# Altium project ecs8a.PrjPcb
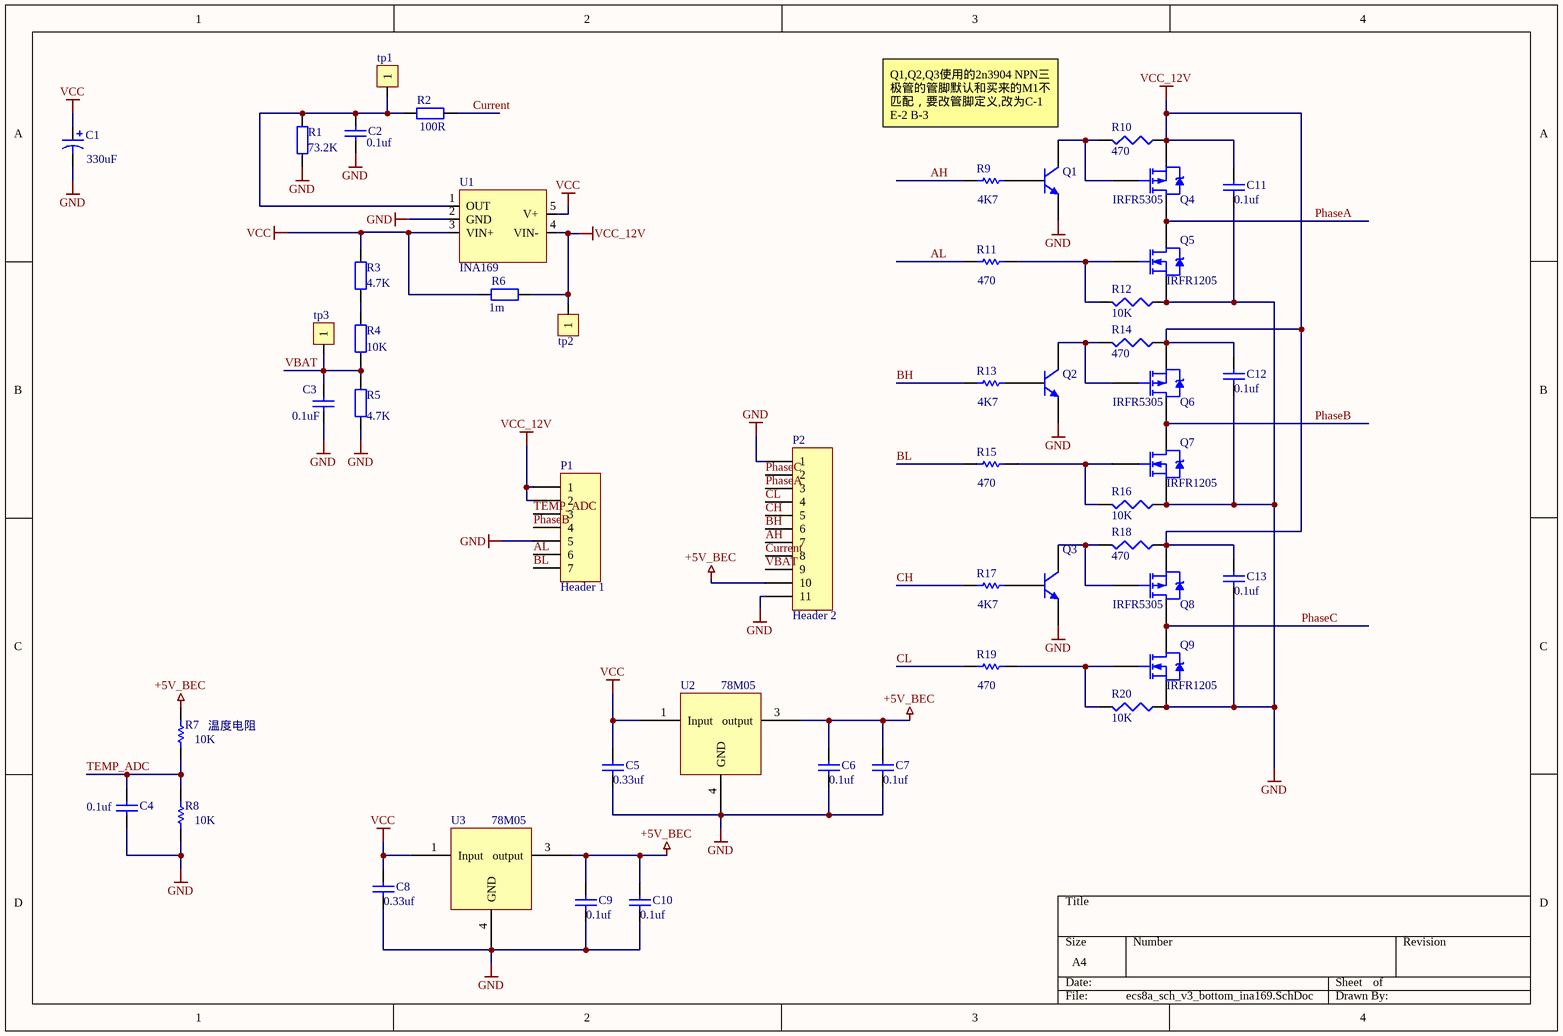
[diagram p0: ecs8a_sch_v3_bottom_ina169.SchDoc]
3 sheets, 131 parts. Net scope: global (net labels, ports and power ports of the same name join across sheets).
Board files: ecs8a_v3_bottom_ina169.PcbDoc, ecs8a_v3_bottom.PcbDoc, ecs8a_v3_top.PcbDoc
Sheets:
  ecs8a_sch_v3_bottom_ina169.SchDoc
  ecs8a_sch_v3_bottom.SchDoc
  ecs8a_sch_v3_top.SchDoc

## Sheet ecs8a_sch_v3_bottom_ina169.SchDoc
size A4

### Parts
(Parts that share a designator on the sheet are numbered #1, #2 ... from top to bottom, then left to right.)
C1#1  value 330uF  [D_C]  (hidden comment: Cap Pol1)
C2#1  value 0.1uf  [6-0805_L]  (hidden comment: Cap)
C3#1  value 0.1uF  [6-0805_L]  (hidden comment: Cap)
C4#1  value 0.1uf  [6-0805_L]  (hidden comment: Cap)
C5#1  value 0.33uf  [C1206]  (hidden comment: Cap)
C6#1  value 0.1uf  [6-0805_L]  (hidden comment: Cap)
C7#1  value 0.1uf  [6-0805_L]  (hidden comment: Cap)
C8#1  value 0.33uf  [C1206]  (hidden comment: Cap)
C9#1  value 0.1uf  [6-0805_L]  (hidden comment: Cap)
C10#1  value 0.1uf  [6-0805_L]  (hidden comment: Cap)
C11#1  value 0.1uf  [6-0805_L]  (hidden comment: Cap)
C12#1  value 0.1uf  [6-0805_L]  (hidden comment: Cap)
C13#1  value 0.1uf  [6-0805_L]  (hidden comment: Cap)
P1#1  Header 1  [7PIN_2.54]
P2#1  Header 2  [11PIN_2.54]
Q1#1  2N3904  [SOT23_L]  (value not drawn)
Q2#1  2N3904  [SOT23_L]  (value not drawn)
Q3#1  2N3904  [SOT23_L]  (value not drawn)
Q4#1  IRFR5305  [TO-252AA]
Q5#1  IRFR1205  [TO-252AA]
Q6#1  IRFR5305  [TO-252AA]
Q7#1  IRFR1205  [TO-252AA]
Q8#1  IRFR5305  [TO-252AA]
Q9#1  IRFR1205  [TO-252AA]
R1#1  value 73.2K  [0603]  (hidden comment: Res2)
R2#1  value 100R  [6-0805_L]  (hidden comment: Res2)
R3#1  value 4.7K  [6-0805_L]  (hidden comment: Res2)
R4#1  value 10K  [6-0805_L]  (hidden comment: Res2)
R5#1  value 4.7K  [6-0805_L]  (hidden comment: Res2)
R6#1  value 1m  [2512_R]  (hidden comment: Res2)
R7#1  温度电阻  value 10K  [6-0805_L]
R8#1  value 10K  [6-0805_L]  (hidden comment: Res1)
R9#1  value 4K7  [6-0805_L]  (hidden comment: Res1)
R10#1  value 470  [6-0805_L]  (hidden comment: Res3)
R11#1  value 470  [6-0805_L]  (hidden comment: Res1)
R12#1  value 10K  [6-0805_L]  (hidden comment: Res3)
R13#1  value 4K7  [6-0805_L]  (hidden comment: Res1)
R14#1  value 470  [6-0805_L]  (hidden comment: Res3)
R15#1  value 470  [6-0805_L]  (hidden comment: Res1)
R16#1  value 10K  [6-0805_L]  (hidden comment: Res3)
R17#1  value 4K7  [6-0805_L]  (hidden comment: Res1)
R18#1  value 470  [6-0805_L]  (hidden comment: Res3)
R19  value 470  [6-0805_L]  (hidden comment: Res1)
R20  value 10K  [6-0805_L]  (hidden comment: Res3)
tp1#1  tp  [tp]  (value not drawn)
tp2  tp  [tp]  (value not drawn)
tp3  tp  [tp]  (value not drawn)
U1#1  INA169  [SOT23-5]
U2#1  78M05  [TO-252AA]
U3#1  78M05  [TO-252AA]

### Nets
+5V_BEC: C6#1.1 C7#1.1 C9#1.1 C10#1.1 P2#1.10 R7#1.2 U2#1.3(output) U3#1.3(output)
GND: C1#1.2 C2#1.1 C3#1.1 C4#1.1 C5#1.2 C6#1.2 C7#1.2 C8#1.2 C9#1.2 C10#1.2 C11#1.1 C12#1.1 C13#1.1 P1#1.5 P2#1.1 P2#1.11 Q1#1.2(E) Q2#1.2(E) Q3#1.2(E) Q5#1.3(S) Q7#1.3(S) Q9#1.3(S) R1#1.1 R5#1.1 R8#1.1 R12#1.1 R16#1.1 R20.1 U1#1.2(GND) U2#1.4(GND) U3#1.4(GND)
VCC: C1#1.1 C5#1.1 C8#1.1 R3#1.2 R6#1.1 U1#1.3(VIN+) U1#1.5(V+) U2#1.1(Input) U3#1.1(Input)
VCC_12V: C11#1.2 C12#1.2 C13#1.2 P1#1.1 P1#1.2 Q4#1.3(S) Q6#1.3(S) Q8#1.3(S) R6#1.2 R10#1.1 R14#1.1 R18#1.1 tp2.1 U1#1.4(VIN-)
AH: P2#1.7 R9#1.2
AL: P1#1.6 R11#1.2
BH: P2#1.6 R13#1.2
BL: P1#1.7 R15#1.2
CH: P2#1.5 R17#1.2
CL: P2#1.4 R19.2
Current: P2#1.8 R2#1.2
PhaseA: P2#1.3 Q4#1.4(D) Q5#1.4(D)
PhaseB: P1#1.4 Q6#1.4(D) Q7#1.4(D)
PhaseC: P2#1.2 Q8#1.4(D) Q9#1.4(D)
TEMP_ADC: C4#1.2 P1#1.3 R7#1.1 R8#1.2
VBAT: C3#1.2 P2#1.9 R4#1.1 R5#1.2 tp3.1
NetC2#1_2: C2#1.2 R1#1.2 R2#1.1 tp1#1.1 U1#1.1(OUT)
NetQ1#1_1: Q1#1.1(C) Q4#1.1(G) R10#1.2
NetQ1#1_3: Q1#1.3(B) R9#1.1
NetQ2#1_1: Q2#1.1(C) Q6#1.1(G) R14#1.2
NetQ2#1_3: Q2#1.3(B) R13#1.1
NetQ3#1_1: Q3#1.1(C) Q8#1.1(G) R18#1.2
NetQ3#1_3: Q3#1.3(B) R17#1.1
NetQ5#1_1: Q5#1.1(G) R11#1.1 R12#1.2
NetQ7#1_1: Q7#1.1(G) R15#1.1 R16#1.2
NetQ9#1_1: Q9#1.1(G) R19.1 R20.2
NetR3#1_1: R3#1.1 R4#1.2

### Notes on the sheet
- Q1,Q2,Q3使用的2n3904 NPN三极管的管脚默认和买来的M1不匹配，要改管脚定义,改为C-1 E-2 B-3

### Library data of the parts
C1#1 = Cap Pol1: Polarized Capacitor (Radial); Published: 8-Jun-2000; LatestRevisionDate: 17-Jul-2002; LatestRevisionNote: Re-released for DXP Platform.; PackageReference: RB7.6-15; Publisher: Altium Limited; PackageDescription: Polarized Capacitor (Radial); 2 Leads
C2#1 C3#1 C4#1 C5#1 C6#1 C7#1 C8#1 C9#1 C10#1 C11#1 C12#1 C13#1 = Cap: Capacitor; Published: 8-Jun-2000; LatestRevisionDate: 17-Jul-2002; LatestRevisionNote: Re-released for DXP Platform.; PackageReference: RAD-0.3; Publisher: Altium Limited; PackageDescription: Radial Cap, Thru-Hole; 2 Leads; 0.3 in Pin Spacing
P1#1 = Header 7: Header, 7-Pin; LatestRevisionDate: 17-Jul-2002; LatestRevisionNote: Re-released for DXP Platform.; Publisher: Altium Limited
P2#1 = Header 11: Header, 11-Pin; LatestRevisionDate: 17-Jul-2002; LatestRevisionNote: Re-released for DXP Platform.; Publisher: Altium Limited
Q1#1 Q2#1 Q3#1 = 2N3904: NPN General Purpose Amplifier; Published: 8-Jun-2000; LatestRevisionDate: 15-Jan-2003; LatestRevisionNote: PCB Footprint 'BCY-W3/D4.7' replaced; DatasheetVersion: 1997; PackageVersion: Sep-1998; PackageReference: TO-92A; Publisher: Altium Limited; PackageDescription: TO, Flat Index; 3 In-Line, Axial Leads; Body Dia. 4.5mm; Leads 0.51 x 0.48 mm (max); ComponentLink1Description: Manufacturer Link; ComponentLink1URL: http://www.fairchildsemi.com/; ComponentLink2Description: Datasheet; ComponentLink2URL: http://www.fairchildsemi.com/ds/2N%2F2N3904.pdf
Q4#1 Q6#1 Q8#1 = IRFR5305: HEXFET Power MOSFET; Manufacturer: International Rectifier; Class I: Discrete; Class II: MOSFET - Power; Note: Pin 2 is trimmed and is electrically connected to Drain.; Published: 8-Jun-2000; Revision: July-2002: Re-released for DXP Platform.; Datasheet: Latest Revision: PD-9.1402; Package Reference: TO-252AA; Publisher: Altium Limited
Q5#1 Q7#1 Q9#1 = IRFR1205: HEXFET Power MOSFET; Manufacturer: International Rectifier; Class I: Discrete; Class II: MOSFET - Power; Note: Pin 2 is trimmed and is electrically connected to Drain.; Published: 8-Jun-2000; Revision: July-2002: Re-released for DXP Platform.; Datasheet: Latest Revision: PD-91318B; Package Reference: TO-252AA; Publisher: Altium Limited
R1#1 R2#1 R3#1 R4#1 R5#1 R6#1 = Res2: Resistor; Published: 8-Jun-2000; LatestRevisionDate: 17-Jul-2002; LatestRevisionNote: Re-released for DXP Platform.; PackageReference: AXIAL-0.4; Publisher: Altium Limited; PackageDescription: Axial Device, Thru-Hole; 2 Leads; 0.4 in Pin Spacing
R7#1 R8#1 R9#1 R11#1 R13#1 R15#1 R17#1 R19 = Res1: Resistor; Published: 8-Jun-2000; LatestRevisionDate: 17-Jul-2002; LatestRevisionNote: Re-released for DXP Platform.; PackageReference: AXIAL-0.3; Publisher: Altium Limited; PackageDescription: Axial Device, Thru-Hole; 2 Leads; 0.3 in Pin Spacing
R10#1 R12#1 R14#1 R16#1 R18#1 R20 = Res3: Resistor; Published: 8-Jun-2000; LatestRevisionDate: 29-May-2009; LatestRevisionNote: IPC-7351 Footprint Added.; PackageReference: J1-0603; Publisher: Altium Limited; PackageDescription: Chip Resistor
U2#1 U3#1 = Component_1

## Sheet ecs8a_sch_v3_bottom.SchDoc
size A4
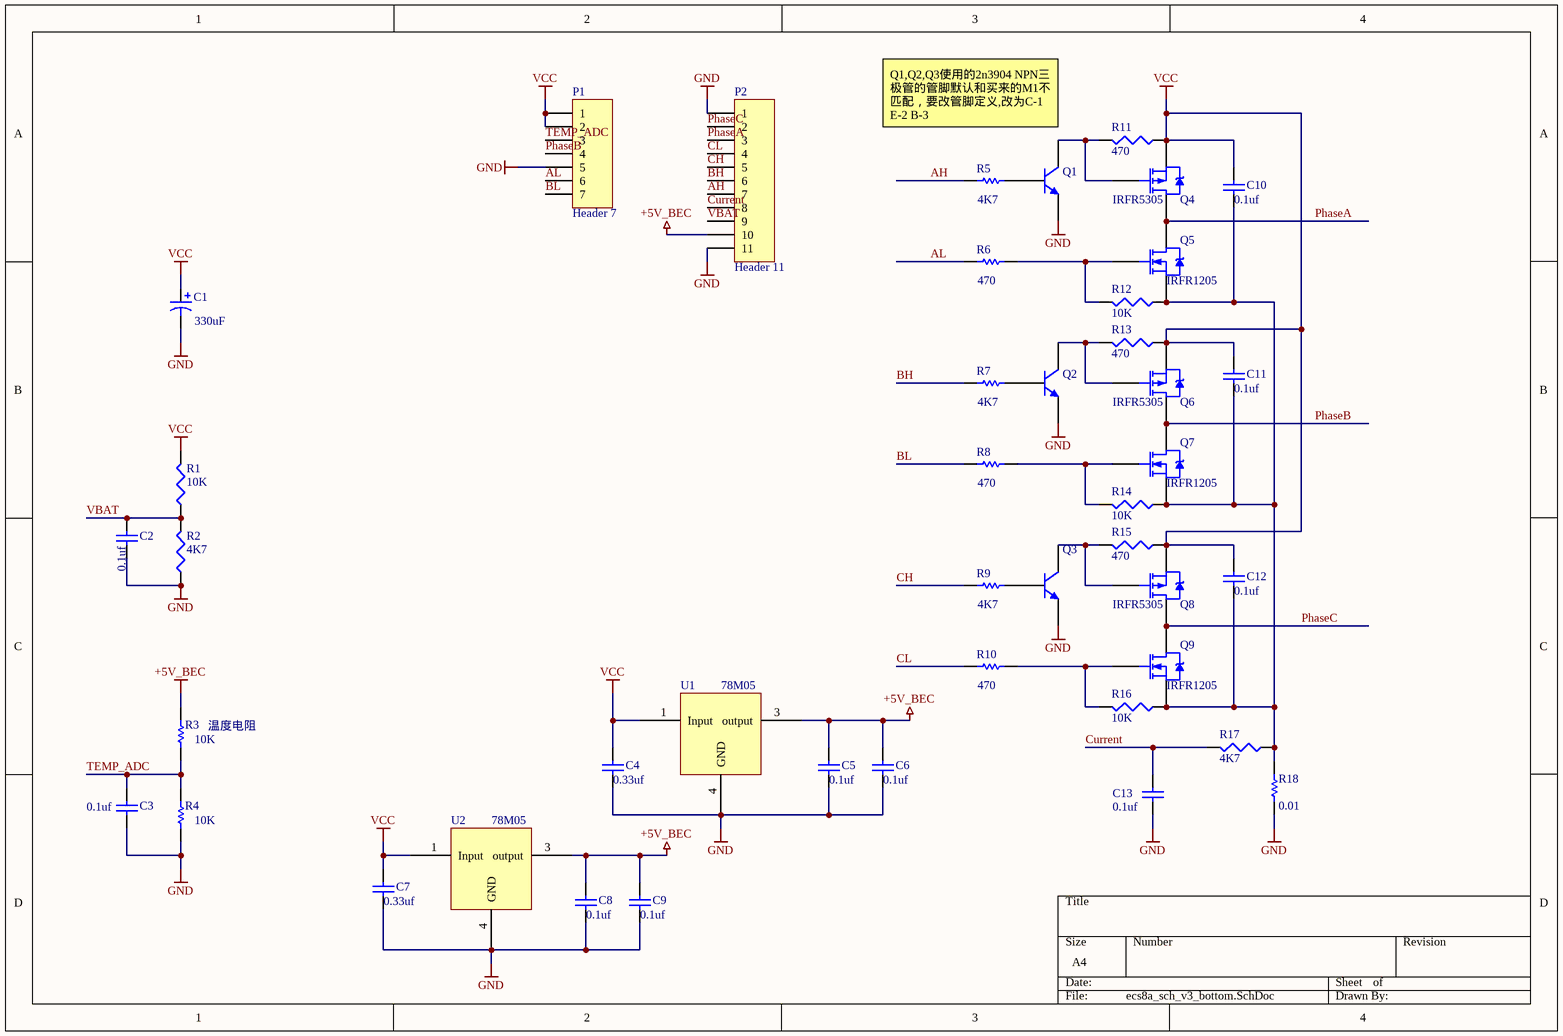
[diagram p1: ecs8a_sch_v3_bottom.SchDoc]

### Parts
(Parts that share a designator on the sheet are numbered #1, #2 ... from top to bottom, then left to right.)
C1#2  value 330uF  [D_C]  (hidden comment: Cap Pol1)
C2#2  value 0.1uf  [6-0805_L]  (hidden comment: Cap)
C3#2  value 0.1uf  [6-0805_L]  (hidden comment: Cap)
C4#2  value 0.33uf  [C1206]  (hidden comment: Cap)
C5#2  value 0.1uf  [6-0805_L]  (hidden comment: Cap)
C6#2  value 0.1uf  [6-0805_L]  (hidden comment: Cap)
C7#2  value 0.33uf  [C1206]  (hidden comment: Cap)
C8#2  value 0.1uf  [6-0805_L]  (hidden comment: Cap)
C9#2  value 0.1uf  [6-0805_L]  (hidden comment: Cap)
C10#2  value 0.1uf  [6-0805_L]  (hidden comment: Cap)
C11#2  value 0.1uf  [6-0805_L]  (hidden comment: Cap)
C12#2  value 0.1uf  [6-0805_L]  (hidden comment: Cap)
C13#2  value 0.1uf  [6-0805_L]  (hidden comment: Cap)
P1#2  Header 7  [7PIN_2.54]
P2#2  Header 11  [11PIN_2.54]
Q1#2  2N3904  [SOT23_L]  (value not drawn)
Q2#2  2N3904  [SOT23_L]  (value not drawn)
Q3#2  2N3904  [SOT23_L]  (value not drawn)
Q4#2  IRFR5305  [TO-252AA]
Q5#2  IRFR1205  [TO-252AA]
Q6#2  IRFR5305  [TO-252AA]
Q7#2  IRFR1205  [TO-252AA]
Q8#2  IRFR5305  [TO-252AA]
Q9#2  IRFR1205  [TO-252AA]
R1#2  value 10K  [6-0805_L]  (hidden comment: Res3)
R2#2  value 4K7  [6-0805_L]  (hidden comment: Res3)
R3#2  温度电阻  value 10K  [6-0805_L]
R4#2  value 10K  [6-0805_L]  (hidden comment: Res1)
R5#2  value 4K7  [6-0805_L]  (hidden comment: Res1)
R6#2  value 470  [6-0805_L]  (hidden comment: Res1)
R7#2  value 4K7  [6-0805_L]  (hidden comment: Res1)
R8#2  value 470  [6-0805_L]  (hidden comment: Res1)
R9#2  value 4K7  [6-0805_L]  (hidden comment: Res1)
R10#2  value 470  [6-0805_L]  (hidden comment: Res1)
R11#2  value 470  [6-0805_L]  (hidden comment: Res3)
R12#2  value 10K  [6-0805_L]  (hidden comment: Res3)
R13#2  value 470  [6-0805_L]  (hidden comment: Res3)
R14#2  value 10K  [6-0805_L]  (hidden comment: Res3)
R15#2  value 470  [6-0805_L]  (hidden comment: Res3)
R16#2  value 10K  [6-0805_L]  (hidden comment: Res3)
R17#2  value 4K7  [6-0805_L]  (hidden comment: Res3)
R18#2  value 0.01  [2512_R]  (hidden comment: Res1)
U1#2  78M05  [TO-252AA]
U2#2  78M05  [TO-252AA]

### Nets
+5V_BEC: C5#2.1 C6#2.1 C8#2.1 C9#2.1 P2#2.10 R3#2.2 U1#2.3(output) U2#2.3(output)
GND: C1#2.2 C2#2.2 C3#2.1 C4#2.2 C5#2.2 C6#2.2 C7#2.2 C8#2.2 C9#2.2 C13#2.1 P1#2.5 P2#2.1 P2#2.11 Q1#2.2(E) Q2#2.2(E) Q3#2.2(E) R2#2.1 R4#2.1 R18#2.1 U1#2.4(GND) U2#2.4(GND)
VCC: C1#2.1 C4#2.1 C7#2.1 C10#2.2 C11#2.2 C12#2.2 P1#2.1 P1#2.2 Q4#2.3(S) Q6#2.3(S) Q8#2.3(S) R1#2.2 R11#2.1 R13#2.1 R15#2.1 U1#2.1(Input) U2#2.1(Input)
AH: P2#2.7 R5#2.2
AL: P1#2.6 R6#2.2
BH: P2#2.6 R7#2.2
BL: P1#2.7 R8#2.2
CH: P2#2.5 R9#2.2
CL: P2#2.4 R10#2.2
Current: C13#2.2 P2#2.8 R17#2.2
PhaseA: P2#2.3 Q4#2.4(D) Q5#2.4(D)
PhaseB: P1#2.4 Q6#2.4(D) Q7#2.4(D)
PhaseC: P2#2.2 Q8#2.4(D) Q9#2.4(D)
TEMP_ADC: C3#2.2 P1#2.3 R3#2.1 R4#2.2
VBAT: C2#2.1 P2#2.9 R1#2.1 R2#2.2
NetC10#2_1: C10#2.1 C11#2.1 C12#2.1 Q5#2.3(S) Q7#2.3(S) Q9#2.3(S) R12#2.1 R14#2.1 R16#2.1 R17#2.1 R18#2.2
NetQ1#2_1: Q1#2.1(C) Q4#2.1(G) R11#2.2
NetQ1#2_3: Q1#2.3(B) R5#2.1
NetQ2#2_1: Q2#2.1(C) Q6#2.1(G) R13#2.2
NetQ2#2_3: Q2#2.3(B) R7#2.1
NetQ3#2_1: Q3#2.1(C) Q8#2.1(G) R15#2.2
NetQ3#2_3: Q3#2.3(B) R9#2.1
NetQ5#2_1: Q5#2.1(G) R6#2.1 R12#2.2
NetQ7#2_1: Q7#2.1(G) R8#2.1 R14#2.2
NetQ9#2_1: Q9#2.1(G) R10#2.1 R16#2.2

### Notes on the sheet
- Q1,Q2,Q3使用的2n3904 NPN三极管的管脚默认和买来的M1不匹配，要改管脚定义,改为C-1 E-2 B-3

### Library data of the parts
C1#2 = Cap Pol1: Polarized Capacitor (Radial); Published: 8-Jun-2000; LatestRevisionDate: 17-Jul-2002; LatestRevisionNote: Re-released for DXP Platform.; PackageReference: RB7.6-15; Publisher: Altium Limited; PackageDescription: Polarized Capacitor (Radial); 2 Leads
C2#2 C3#2 C4#2 C5#2 C6#2 C7#2 C8#2 C9#2 C10#2 C11#2 C12#2 C13#2 = Cap: Capacitor; Published: 8-Jun-2000; LatestRevisionDate: 17-Jul-2002; LatestRevisionNote: Re-released for DXP Platform.; PackageReference: RAD-0.3; Publisher: Altium Limited; PackageDescription: Radial Cap, Thru-Hole; 2 Leads; 0.3 in Pin Spacing
P1#2 = Header 7: Header, 7-Pin; LatestRevisionDate: 17-Jul-2002; LatestRevisionNote: Re-released for DXP Platform.; Publisher: Altium Limited
P2#2 = Header 11: Header, 11-Pin; LatestRevisionDate: 17-Jul-2002; LatestRevisionNote: Re-released for DXP Platform.; Publisher: Altium Limited
Q1#2 Q2#2 Q3#2 = 2N3904: NPN General Purpose Amplifier; Published: 8-Jun-2000; LatestRevisionDate: 15-Jan-2003; LatestRevisionNote: PCB Footprint 'BCY-W3/D4.7' replaced; DatasheetVersion: 1997; PackageVersion: Sep-1998; PackageReference: TO-92A; Publisher: Altium Limited; PackageDescription: TO, Flat Index; 3 In-Line, Axial Leads; Body Dia. 4.5mm; Leads 0.51 x 0.48 mm (max); ComponentLink1Description: Manufacturer Link; ComponentLink1URL: http://www.fairchildsemi.com/; ComponentLink2Description: Datasheet; ComponentLink2URL: http://www.fairchildsemi.com/ds/2N%2F2N3904.pdf
Q4#2 Q6#2 Q8#2 = IRFR5305: as Q4#1 on sheet ecs8a_sch_v3_bottom_ina169; Published: 8-Jun-2000; Revision: July-2002: Re-released for DXP Platform.; Datasheet: Latest Revision: PD-9.1402; Package Reference: TO-252AA; Publisher: Altium Limited
Q5#2 Q7#2 Q9#2 = IRFR1205: as Q5#1 on sheet ecs8a_sch_v3_bottom_ina169; Published: 8-Jun-2000; Revision: July-2002: Re-released for DXP Platform.; Datasheet: Latest Revision: PD-91318B; Package Reference: TO-252AA; Publisher: Altium Limited
R1#2 R2#2 R11#2 R12#2 R13#2 R14#2 R15#2 R16#2 R17#2 = Res3: Resistor; Published: 8-Jun-2000; LatestRevisionDate: 29-May-2009; LatestRevisionNote: IPC-7351 Footprint Added.; PackageReference: J1-0603; Publisher: Altium Limited; PackageDescription: Chip Resistor
R3#2 R4#2 R5#2 R6#2 R7#2 R8#2 R9#2 R10#2 R18#2 = Res1: Resistor; Published: 8-Jun-2000; LatestRevisionDate: 17-Jul-2002; LatestRevisionNote: Re-released for DXP Platform.; PackageReference: AXIAL-0.3; Publisher: Altium Limited; PackageDescription: Axial Device, Thru-Hole; 2 Leads; 0.3 in Pin Spacing
U1#2 U2#2 = Component_1

## Sheet ecs8a_sch_v3_top.SchDoc
size A4
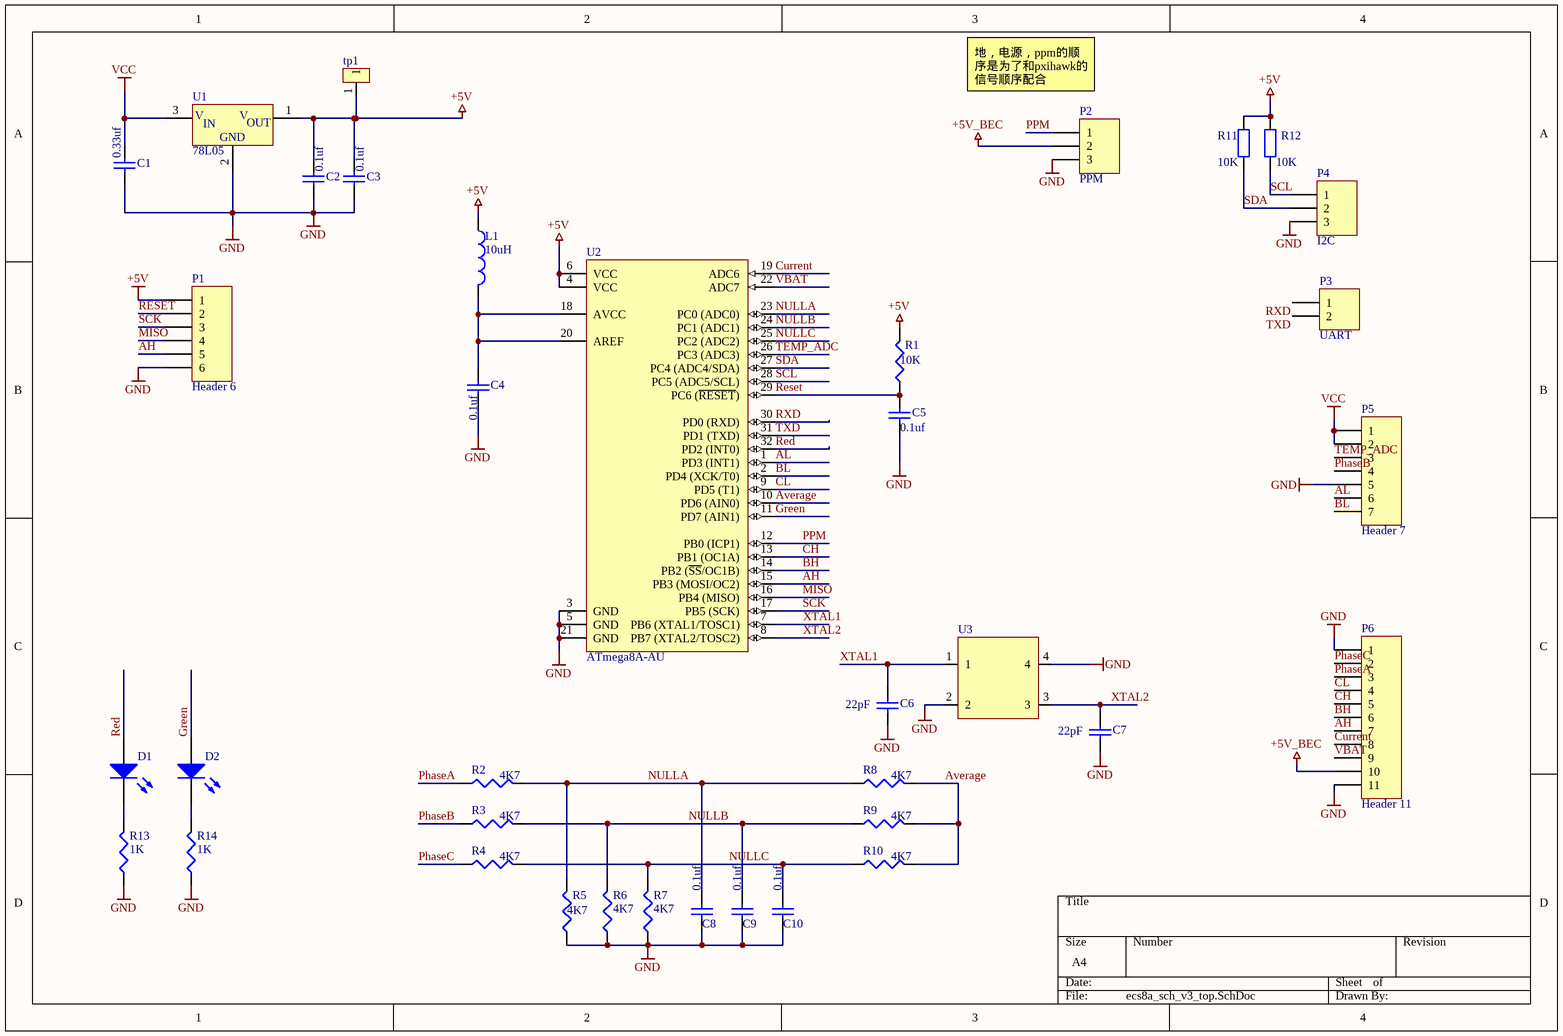
[diagram p2: ecs8a_sch_v3_top.SchDoc]

### Parts
(Parts that share a designator on the sheet are numbered #1, #2 ... from top to bottom, then left to right.)
C1#3  value 0.33uf  [C1206]  (hidden comment: Cap)
C2#3  value 0.1uf  [6-0805_L]  (hidden comment: Cap)
C3#3  value 0.1uf  [6-0805_L]  (hidden comment: Cap)
C4#3  value 0.1uf  [6-0805_L]  (hidden comment: Cap)
C5#3  value 0.1uf  [6-0805_L]  (hidden comment: Cap)
C6#3  value 22pF  [6-0805_L]  (hidden comment: Cap)
C7#3  value 22pF  [6-0805_L]  (hidden comment: Cap)
C8#3  value 0.1uf  [6-0805_L]  (hidden comment: Cap)
C9#3  value 0.1uf  [6-0805_L]  (hidden comment: Cap)
C10#3  value 0.1uf  [6-0805_L]  (hidden comment: Cap)
D1  LED0  [6-0805_L]  (value not drawn)
D2  LED0  [6-0805_L]  (value not drawn)
L1  value 10uH  [6-0805_L]  (hidden comment: Inductor)
P1#3  Header 6  [6pin_2mm]
P2#3  PPM  [PPM_HEADER2]
P3  UART  [USART_HEADER]
P4  I2C  [PPM_HEADER2]
P5  Header 7  [7PIN_2.54]
P6  Header 11  [11PIN_2.54]
R1#3  value 10K  [6-0805_L]  (hidden comment: Res3)
R2#3  value 4K7  [6-0805_L]  (hidden comment: Res3)
R3#3  value 4K7  [6-0805_L]  (hidden comment: Res3)
R4#3  value 4K7  [6-0805_L]  (hidden comment: Res3)
R5#3  value 4K7  [6-0805_L]  (hidden comment: Res3)
R6#3  value 4K7  [6-0805_L]  (hidden comment: Res3)
R7#3  value 4K7  [6-0805_L]  (hidden comment: Res3)
R8#3  value 4K7  [6-0805_L]  (hidden comment: Res3)
R9#3  value 4K7  [6-0805_L]  (hidden comment: Res3)
R10#3  value 4K7  [6-0805_L]  (hidden comment: Res3)
R11#3  value 10K  [6-0805_L]  (hidden comment: Res2)
R12#3  value 10K  [6-0805_L]  (hidden comment: Res2)
R13#3  value 1K  [6-0805_L]  (hidden comment: Res3)
R14#3  value 1K  [6-0805_L]  (hidden comment: Res3)
tp1#2  tp  [tp]  (value not drawn)
U1#3  78L05  [SOT89L]
U2#3  ATmega8A-AU  [32A_N]
U3#2  3225_16M  [3225_16M]  (value not drawn)

### Nets
+5V: C2#3.2 C3#3.2 L1.1 P1#3.1 R1#3.2 R11#3.2 R12#3.2 tp1#2.1 U1#3.1(VOUT) U2#3.4(VCC) U2#3.6(VCC)
+5V_BEC: P2#3.2 P6.10
GND: C1#3.1 C2#3.1 C3#3.1 C4#3.2 C5#3.1 C6#3.2 C7#3.2 C8#3.2 C9#3.2 C10#3.2 P1#3.6 P2#3.3 P4.3 P5.5 P6.1 P6.11 R5#3.1 R6#3.1 R7#3.1 R13#3.1 R14#3.1 U1#3.2(GND) U2#3.3(GND) U2#3.5(GND) U2#3.21(GND) U3#2.2 U3#2.4
VCC: C1#3.2 P5.1 P5.2 U1#3.3(VIN)
AH: P1#3.5 P6.7 U2#3.15(PB3_(MOSI/OC2))
AL: P5.6 U2#3.1(PD3_(INT1))
Average: R8#3.2 R9#3.2 R10#3.2 U2#3.10(PD6_(AIN0))
BH: P6.6 U2#3.14(PB2_(~{SS}/OC1B))
BL: P5.7 U2#3.2(PD4_(XCK/T0))
CH: P6.5 U2#3.13(PB1_(OC1A))
CL: P6.4 U2#3.9(PD5_(T1))
Current: P6.8 U2#3.19(ADC6)
Green: D2.1(A) U2#3.11(PD7_(AIN1))
MISO: P1#3.4 U2#3.16(PB4_(MISO))
NULLA: C8#3.1 R2#3.2 R5#3.2 R8#3.1 U2#3.23(PC0_(ADC0))
NULLB: C9#3.1 R3#3.2 R6#3.2 R9#3.1 U2#3.24(PC1_(ADC1))
NULLC: C10#3.1 R4#3.2 R7#3.2 R10#3.1 U2#3.25(PC2_(ADC2))
PhaseA: P6.3 R2#3.1
PhaseB: P5.4 R3#3.1
PhaseC: P6.2 R4#3.1
PPM: P2#3.1 U2#3.12(PB0_(ICP1))
Red: D1.1(A) U2#3.32(PD2_(INT0))
Reset: C5#3.2 P1#3.2 R1#3.1 U2#3.29(PC6_(~{RESET}))
RXD: P3.1 U2#3.30(PD0_(RXD))
SCK: P1#3.3 U2#3.17(PB5_(SCK))
SCL: P4.1 R12#3.1 U2#3.28(PC5_(ADC5/SCL))
SDA: P4.2 R11#3.1 U2#3.27(PC4_(ADC4/SDA))
TEMP_ADC: P5.3 U2#3.26(PC3_(ADC3))
TXD: P3.2 U2#3.31(PD1_(TXD))
VBAT: P6.9 U2#3.22(ADC7)
XTAL1: C6#3.1 U2#3.7(PB6_(XTAL1/TOSC1)) U3#2.1
XTAL2: C7#3.1 U2#3.8(PB7_(XTAL2/TOSC2)) U3#2.3
NetC4#3_1: C4#3.1 L1.2 U2#3.18(AVCC) U2#3.20(AREF)
NetD1_2: D1.2(K) R13#3.2
NetD2_2: D2.2(K) R14#3.2

### Notes on the sheet
- (near P2#3) 地，电源，ppm的顺序是为了和pxihawk的信号顺序配合
- (in symbol 78L05) V; IN; OUT

### Library data of the parts
C1#3 C2#3 C3#3 C4#3 C5#3 C6#3 C7#3 C8#3 C9#3 C10#3 = Cap: Capacitor; Published: 8-Jun-2000; LatestRevisionDate: 17-Jul-2002; LatestRevisionNote: Re-released for DXP Platform.; PackageReference: RAD-0.3; Publisher: Altium Limited; PackageDescription: Radial Cap, Thru-Hole; 2 Leads; 0.3 in Pin Spacing
D1 D2 = LED0: Typical INFRARED GaAs LED; Published: 8-Jun-2000; LatestRevisionDate: 08-Jul-2005; LatestRevisionNote: Mech Layer 1 removed.; PackageReference: LED-0; Publisher: Altium Limited
L1 = Inductor: Code_IEC: 1005; Published: 8-Jun-2000; LatestRevisionDate: 17-Jul-2002; LatestRevisionNote: Re-released for DXP Platform.; PackageReference: 0402-A; Publisher: Altium Limited; Code_JEITA: 0402
P1#3 = Header 6: Header, 6-Pin; LatestRevisionDate: 17-Jul-2002; LatestRevisionNote: Re-released for DXP Platform.; Publisher: Altium Limited
P2#3 P4 = Header 3: Header, 3-Pin; LatestRevisionDate: 17-Jul-2002; LatestRevisionNote: Re-released for DXP Platform.; Publisher: Altium Limited
P3 = Header 2: Header, 2-Pin; LatestRevisionDate: 17-Jul-2002; LatestRevisionNote: Re-released for DXP Platform.; Publisher: Altium Limited
P5 = Header 7: Header, 7-Pin; LatestRevisionDate: 17-Jul-2002; LatestRevisionNote: Re-released for DXP Platform.; Publisher: Altium Limited
P6 = Header 11: Header, 11-Pin; LatestRevisionDate: 17-Jul-2002; LatestRevisionNote: Re-released for DXP Platform.; Publisher: Altium Limited
R1#3 R2#3 R3#3 R4#3 R5#3 R6#3 R7#3 R8#3 R9#3 R10#3 R13#3 R14#3 = Res3: Resistor; Published: 8-Jun-2000; LatestRevisionDate: 29-May-2009; LatestRevisionNote: IPC-7351 Footprint Added.; PackageReference: J1-0603; Publisher: Altium Limited; PackageDescription: Chip Resistor
R11#3 R12#3 = Res2: Resistor; Published: 8-Jun-2000; LatestRevisionDate: 17-Jul-2002; LatestRevisionNote: Re-released for DXP Platform.; PackageReference: AXIAL-0.4; Publisher: Altium Limited; PackageDescription: Axial Device, Thru-Hole; 2 Leads; 0.4 in Pin Spacing
U1#3 = 78L05: 3-Terminal Positive Voltage Regulator
U2#3 = ATmega8A-AU: 8-bit AVR Microcontroller, 2.7-5.5V, 16MHz, 8KB Flash, 512 Bytes EEPROM, 1KB SRAM, 32-pin TQFP, Industrial Grade (-40癈 to 85癈); DatasheetVersion: revD, Feb-2011; PackageVersion: revC, Oct-2010; PackageReference: 32A; PackageDescription: 32-Lead, 7x7x1.0 mm Body, 0.8mm Lead Pitch, Thin Profile Plastic Quad Flat Package (TQFP); Code_JEDEC: MS-026-ABA; ComponentLink1Description: Manufacturer URL; ComponentLink1URL: http://www.atmel.com/; ComponentLink2Description: ATmega8A Datasheet; ComponentLink2URL: http://www.atmel.com/dyn/resources/prod_documents/doc8159.pdf; ComponentLink3Description: ATmega8A Summary; ComponentLink3URL: http://www.atmel.com/dyn/resources/prod_documents/8159S.pdf

## Nets that join several sheets
+5V_BEC: ecs8a_sch_v3_bottom_ina169 (8 pins), ecs8a_sch_v3_bottom (8 pins), ecs8a_sch_v3_top (P2#3.2 P6.10)
GND: ecs8a_sch_v3_bottom_ina169 (31 pins), ecs8a_sch_v3_bottom (21 pins), ecs8a_sch_v3_top (27 pins)
VCC: ecs8a_sch_v3_bottom_ina169 (9 pins), ecs8a_sch_v3_bottom (17 pins), ecs8a_sch_v3_top (C1#3.2 P5.1 P5.2 U1#3.3)
AH: ecs8a_sch_v3_bottom_ina169 (P2#1.7 R9#1.2), ecs8a_sch_v3_bottom (P2#2.7 R5#2.2), ecs8a_sch_v3_top (P1#3.5 P6.7 U2#3.15)
AL: ecs8a_sch_v3_bottom_ina169 (P1#1.6 R11#1.2), ecs8a_sch_v3_bottom (P1#2.6 R6#2.2), ecs8a_sch_v3_top (P5.6 U2#3.1)
BH: ecs8a_sch_v3_bottom_ina169 (P2#1.6 R13#1.2), ecs8a_sch_v3_bottom (P2#2.6 R7#2.2), ecs8a_sch_v3_top (P6.6 U2#3.14)
BL: ecs8a_sch_v3_bottom_ina169 (P1#1.7 R15#1.2), ecs8a_sch_v3_bottom (P1#2.7 R8#2.2), ecs8a_sch_v3_top (P5.7 U2#3.2)
CH: ecs8a_sch_v3_bottom_ina169 (P2#1.5 R17#1.2), ecs8a_sch_v3_bottom (P2#2.5 R9#2.2), ecs8a_sch_v3_top (P6.5 U2#3.13)
CL: ecs8a_sch_v3_bottom_ina169 (P2#1.4 R19.2), ecs8a_sch_v3_bottom (P2#2.4 R10#2.2), ecs8a_sch_v3_top (P6.4 U2#3.9)
Current: ecs8a_sch_v3_bottom_ina169 (P2#1.8 R2#1.2), ecs8a_sch_v3_bottom (C13#2.2 P2#2.8 R17#2.2), ecs8a_sch_v3_top (P6.8 U2#3.19)
PhaseA: ecs8a_sch_v3_bottom_ina169 (P2#1.3 Q4#1.4 Q5#1.4), ecs8a_sch_v3_bottom (P2#2.3 Q4#2.4 Q5#2.4), ecs8a_sch_v3_top (P6.3 R2#3.1)
PhaseB: ecs8a_sch_v3_bottom_ina169 (P1#1.4 Q6#1.4 Q7#1.4), ecs8a_sch_v3_bottom (P1#2.4 Q6#2.4 Q7#2.4), ecs8a_sch_v3_top (P5.4 R3#3.1)
PhaseC: ecs8a_sch_v3_bottom_ina169 (P2#1.2 Q8#1.4 Q9#1.4), ecs8a_sch_v3_bottom (P2#2.2 Q8#2.4 Q9#2.4), ecs8a_sch_v3_top (P6.2 R4#3.1)
TEMP_ADC: ecs8a_sch_v3_bottom_ina169 (C4#1.2 P1#1.3 R7#1.1 R8#1.2), ecs8a_sch_v3_bottom (C3#2.2 P1#2.3 R3#2.1 R4#2.2), ecs8a_sch_v3_top (P5.3 U2#3.26)
VBAT: ecs8a_sch_v3_bottom_ina169 (5 pins), ecs8a_sch_v3_bottom (C2#2.1 P2#2.9 R1#2.1 R2#2.2), ecs8a_sch_v3_top (P6.9 U2#3.22)